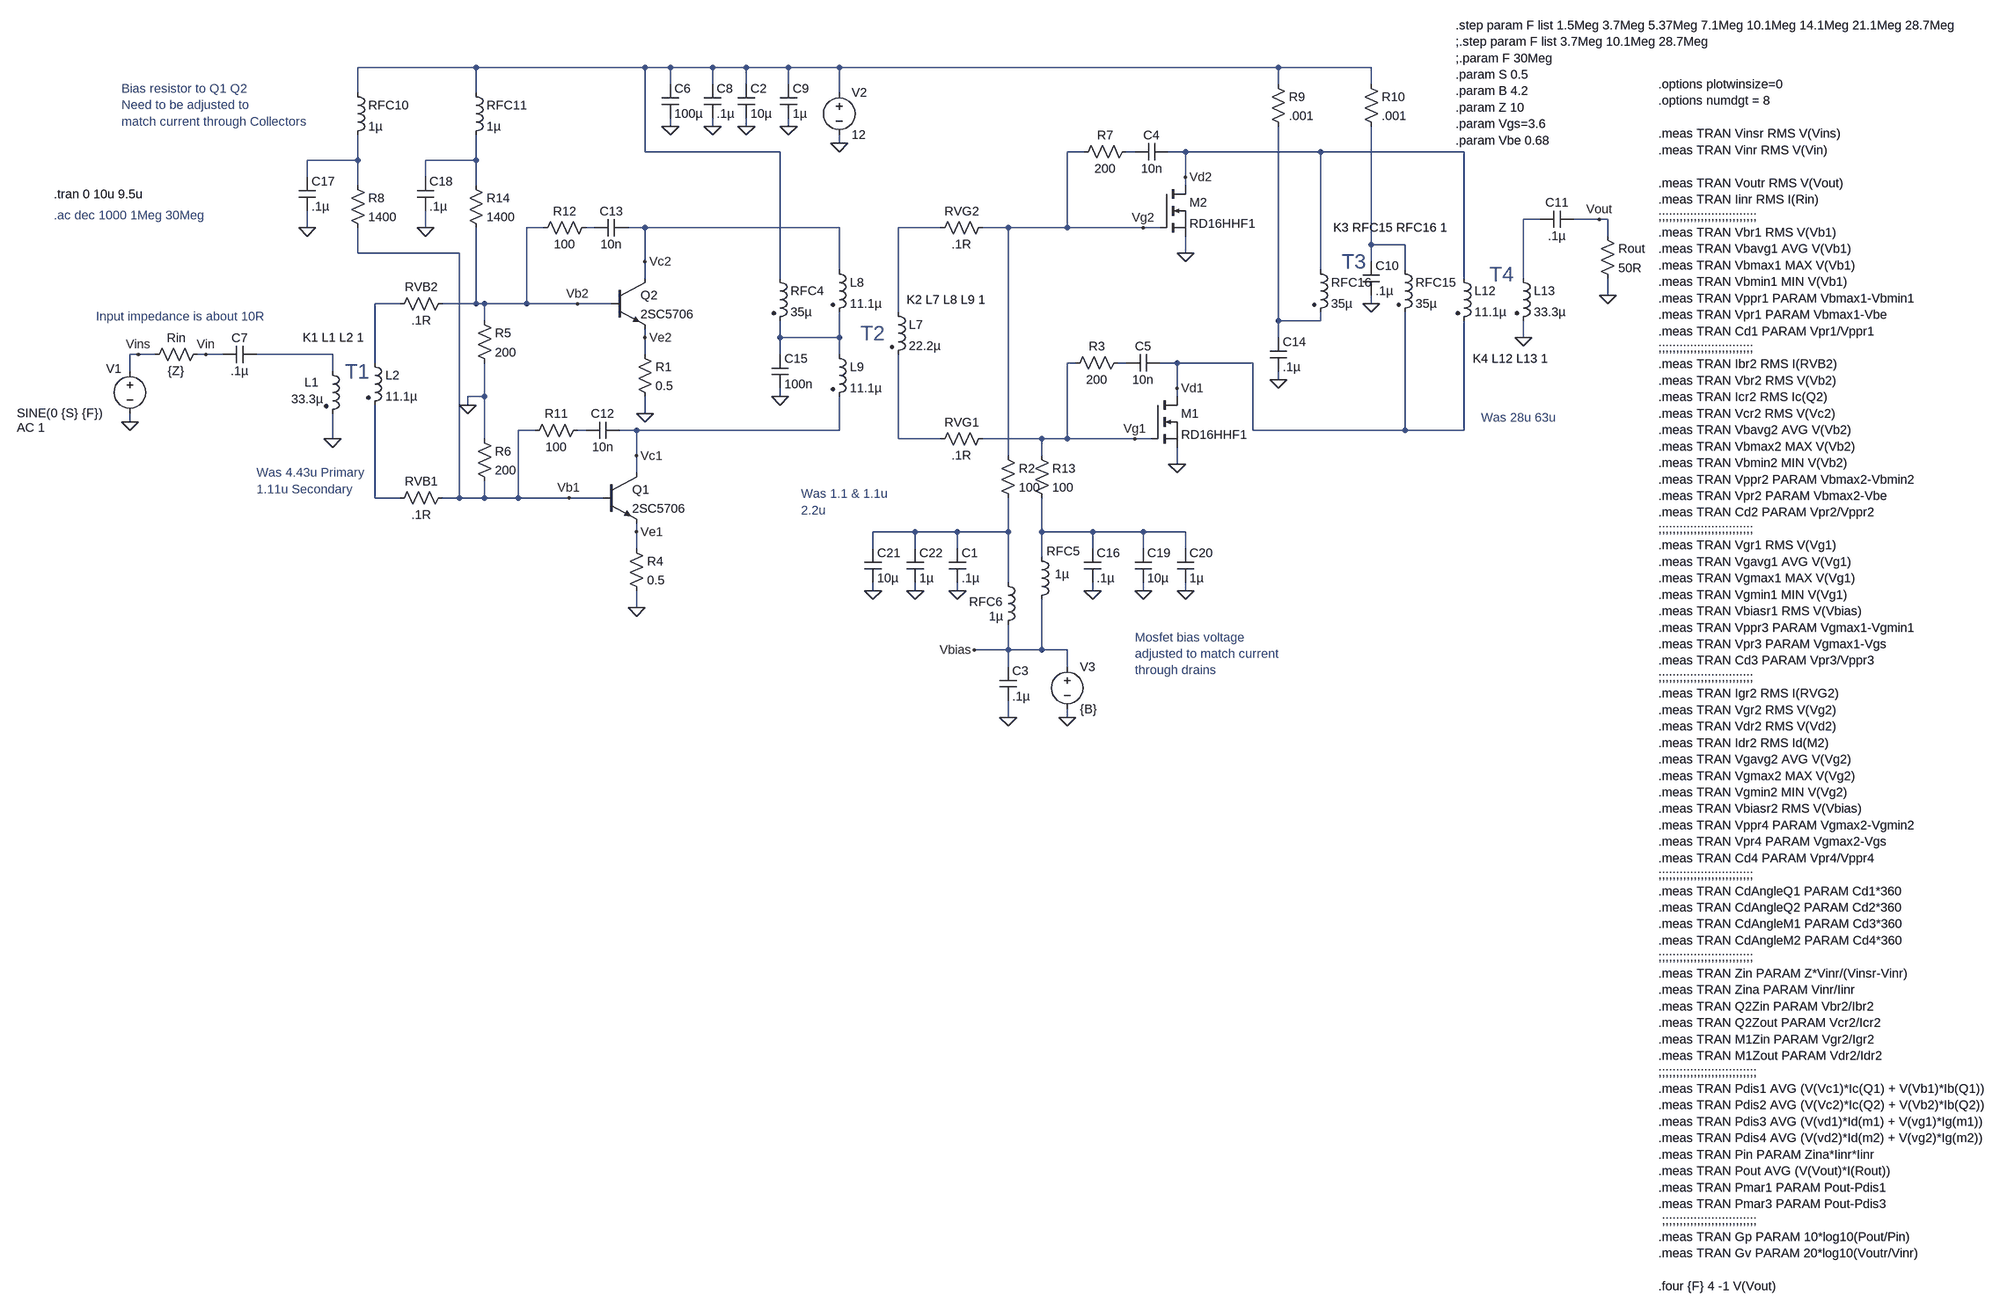
[diagram p0: schematic 2SC5706 RD16HHF 10W.asc]
2SC5706 RD16HHF 10W.asc, the LTspice schematic file:
Version 4
SHEET 1 3748 1496
WIRE 112 -624 -112 -624
WIRE 432 -624 112 -624
WIRE 480 -624 432 -624
WIRE 560 -624 480 -624
WIRE 624 -624 560 -624
WIRE 704 -624 624 -624
WIRE 800 -624 704 -624
WIRE 1632 -624 800 -624
WIRE 1808 -624 1632 -624
WIRE 480 -592 480 -624
WIRE 560 -592 560 -624
WIRE 624 -592 624 -624
WIRE 704 -592 704 -624
WIRE 1632 -592 1632 -624
WIRE 1808 -592 1808 -624
WIRE -112 -576 -112 -624
WIRE 112 -576 112 -624
WIRE 800 -576 800 -624
WIRE 480 -512 480 -528
WIRE 560 -512 560 -528
WIRE 624 -512 624 -528
WIRE 704 -512 704 -528
WIRE 800 -480 800 -496
WIRE 432 -464 432 -624
WIRE 688 -464 432 -464
WIRE 1264 -464 1232 -464
WIRE 1360 -464 1344 -464
WIRE 1456 -464 1424 -464
WIRE 1712 -464 1456 -464
WIRE 1984 -464 1712 -464
WIRE -112 -448 -112 -496
WIRE -112 -448 -208 -448
WIRE 112 -448 112 -496
WIRE 112 -448 16 -448
WIRE -208 -416 -208 -448
WIRE 16 -416 16 -448
WIRE 1456 -416 1456 -464
WIRE -112 -400 -112 -448
WIRE 112 -400 112 -448
WIRE 1456 -400 1456 -416
WIRE 2128 -336 2096 -336
WIRE 2240 -336 2192 -336
WIRE 2256 -336 2240 -336
WIRE -208 -320 -208 -352
WIRE 16 -320 16 -352
WIRE 240 -320 208 -320
WIRE 336 -320 320 -320
WIRE 432 -320 400 -320
WIRE 800 -320 432 -320
WIRE 992 -320 912 -320
WIRE 1120 -320 1072 -320
WIRE 1232 -320 1232 -464
WIRE 1232 -320 1120 -320
WIRE 1376 -320 1232 -320
WIRE 1408 -320 1376 -320
WIRE 2256 -304 2256 -336
WIRE 1808 -288 1808 -512
WIRE 1872 -288 1808 -288
WIRE -112 -272 -112 -320
WIRE 80 -272 -112 -272
WIRE 1456 -272 1456 -304
WIRE 432 -256 432 -320
WIRE 1808 -256 1808 -288
WIRE 800 -240 800 -320
WIRE 1712 -240 1712 -464
WIRE 1872 -240 1872 -288
WIRE 432 -224 432 -256
WIRE 688 -224 688 -464
WIRE 1984 -224 1984 -464
WIRE 2096 -224 2096 -336
WIRE 2256 -192 2256 -224
WIRE -32 -176 -80 -176
WIRE 112 -176 112 -320
WIRE 112 -176 48 -176
WIRE 128 -176 112 -176
WIRE 208 -176 208 -320
WIRE 208 -176 128 -176
WIRE 304 -176 208 -176
WIRE 368 -176 304 -176
WIRE 1808 -176 1808 -192
WIRE 912 -160 912 -320
WIRE 128 -144 128 -176
WIRE 1632 -144 1632 -512
WIRE 1712 -144 1712 -160
WIRE 1712 -144 1632 -144
WIRE 432 -112 432 -128
WIRE 688 -112 688 -144
WIRE 800 -112 800 -160
WIRE 800 -112 688 -112
WIRE 1632 -112 1632 -144
WIRE 2096 -112 2096 -144
WIRE -528 -80 -544 -80
WIRE -496 -80 -528 -80
WIRE -400 -80 -416 -80
WIRE -368 -80 -400 -80
WIRE -160 -80 -304 -80
WIRE 432 -80 432 -112
WIRE 688 -80 688 -112
WIRE 800 -80 800 -112
WIRE -80 -64 -80 -176
WIRE 1248 -64 1232 -64
WIRE 1344 -64 1328 -64
WIRE 1440 -64 1408 -64
WIRE 1584 -64 1440 -64
WIRE -544 -48 -544 -80
WIRE -160 -48 -160 -80
WIRE 1632 -32 1632 -48
WIRE 1440 -16 1440 -64
WIRE 128 0 128 -64
WIRE 128 0 96 0
WIRE 688 0 688 -16
WIRE 1440 0 1440 -16
WIRE 96 16 96 0
WIRE 432 32 432 0
WIRE -544 48 -544 32
WIRE 224 64 192 64
WIRE 320 64 304 64
WIRE 416 64 384 64
WIRE 800 64 800 0
WIRE 800 64 416 64
WIRE 1584 64 1584 -64
WIRE 1872 64 1872 -160
WIRE 1872 64 1584 64
WIRE 1984 64 1984 -144
WIRE 1984 64 1872 64
WIRE -160 80 -160 32
WIRE 128 80 128 0
WIRE 912 80 912 -80
WIRE 992 80 912 80
WIRE 1184 80 1072 80
WIRE 1232 80 1232 -64
WIRE 1232 80 1184 80
WIRE 1360 80 1232 80
WIRE 1392 80 1360 80
WIRE 416 112 416 64
WIRE 1120 112 1120 -320
WIRE 1184 112 1184 80
WIRE 1440 128 1440 96
WIRE 416 144 416 112
WIRE -80 192 -80 16
WIRE -32 192 -80 192
WIRE 80 192 80 -272
WIRE 80 192 48 192
WIRE 128 192 128 160
WIRE 128 192 80 192
WIRE 192 192 192 64
WIRE 192 192 128 192
WIRE 288 192 192 192
WIRE 352 192 288 192
WIRE 416 256 416 240
WIRE 944 256 864 256
WIRE 1024 256 944 256
WIRE 1120 256 1120 192
WIRE 1120 256 1024 256
WIRE 1184 256 1184 192
WIRE 1280 256 1184 256
WIRE 1376 256 1280 256
WIRE 1456 256 1376 256
WIRE 416 288 416 256
WIRE 864 288 864 256
WIRE 944 288 944 256
WIRE 1024 288 1024 256
WIRE 1280 288 1280 256
WIRE 1376 288 1376 256
WIRE 1456 288 1456 256
WIRE 1184 304 1184 256
WIRE 1120 352 1120 256
WIRE 864 368 864 352
WIRE 944 368 944 352
WIRE 1024 368 1024 352
WIRE 1280 368 1280 352
WIRE 1376 368 1376 352
WIRE 1456 368 1456 352
WIRE 416 400 416 368
WIRE 1120 480 1120 432
WIRE 1120 480 1056 480
WIRE 1184 480 1184 384
WIRE 1184 480 1120 480
WIRE 1232 480 1184 480
WIRE 1120 512 1120 480
WIRE 1232 512 1232 480
WIRE 1120 608 1120 576
WIRE 1232 608 1232 592
FLAG 800 -480 0
FLAG -544 48 0
FLAG 416 400 0
FLAG 2240 -336 Vout
FLAG 288 192 Vb1
FLAG 416 256 Ve1
FLAG -400 -80 Vin
FLAG -528 -80 Vins
FLAG 416 112 Vc1
FLAG 432 32 0
FLAG 304 -176 Vb2
FLAG 432 -112 Ve2
FLAG 432 -256 Vc2
FLAG -160 80 0
FLAG 96 16 0
FLAG 624 -512 0
FLAG 704 -512 0
FLAG 480 -512 0
FLAG 560 -512 0
FLAG 1232 608 0
FLAG 1440 128 0
FLAG 1360 80 Vg1
FLAG 1440 -16 Vd1
FLAG 1120 608 0
FLAG 1056 480 Vbias
FLAG 1456 -272 0
FLAG 1376 -320 Vg2
FLAG 1456 -416 Vd2
FLAG 1808 -176 0
FLAG 2096 -112 0
FLAG 2256 -192 0
FLAG 1632 -32 0
FLAG 688 0 0
FLAG 1024 368 0
FLAG 1280 368 0
FLAG -208 -320 0
FLAG 16 -320 0
FLAG 1376 368 0
FLAG 1456 368 0
FLAG 864 368 0
FLAG 944 368 0
SYMBOL npn 352 144 R0
SYMATTR InstName Q1
SYMATTR Value 2SC5706
SYMBOL voltage -544 -64 R0
WINDOW 0 -45 11 Left 2
WINDOW 3 -214 95 Left 2
WINDOW 123 -214 123 Left 2
WINDOW 39 0 0 Left 0
SYMATTR InstName V1
SYMATTR Value SINE(0 {S} {F})
SYMATTR Value2 AC 1
SYMBOL voltage 800 -592 R0
WINDOW 123 0 0 Left 0
WINDOW 39 0 0 Left 0
SYMATTR InstName V2
SYMATTR Value 12
SYMBOL res 400 272 R0
SYMATTR InstName R4
SYMATTR Value 0.5
SYMBOL res 2240 -320 R0
SYMATTR InstName Rout
SYMATTR Value 50R
SYMBOL cap -304 -96 R90
WINDOW 0 0 32 VBottom 2
WINDOW 3 32 32 VTop 2
SYMATTR InstName C7
SYMATTR Value .1µ
SYMBOL res -400 -96 R90
WINDOW 0 0 56 VBottom 2
WINDOW 3 32 56 VTop 2
SYMATTR InstName Rin
SYMATTR Value {Z}
SYMBOL npn 368 -224 R0
SYMATTR InstName Q2
SYMATTR Value 2SC5706
SYMBOL res 416 -96 R0
SYMATTR InstName R1
SYMATTR Value 0.5
SYMBOL ind2 -176 -64 R0
WINDOW 0 -37 37 Left 2
WINDOW 3 -62 69 Left 2
SYMATTR InstName L1
SYMATTR Value 33.3µ
SYMATTR Type ind
SYMBOL ind2 -96 -80 R0
SYMATTR InstName L2
SYMATTR Value 11.1µ
SYMATTR Type ind
SYMBOL res -128 -416 R0
SYMATTR InstName R8
SYMATTR Value 1400
SYMBOL res 112 -160 R0
SYMATTR InstName R5
SYMATTR Value 200
SYMBOL res 112 64 R0
SYMATTR InstName R6
SYMATTR Value 200
SYMBOL ind2 784 -256 R0
SYMATTR InstName L8
SYMATTR Value 11.1µ
SYMATTR Type ind
SYMBOL ind2 896 -176 R0
SYMATTR InstName L7
SYMATTR Value 22.2µ
SYMATTR Type ind
SYMBOL cap 608 -592 R0
SYMATTR InstName C2
SYMATTR Value 10µ
SYMBOL cap 688 -592 R0
SYMATTR InstName C9
SYMATTR Value 1µ
SYMBOL cap 464 -592 R0
SYMATTR InstName C6
SYMATTR Value 100µ
SYMBOL cap 544 -592 R0
SYMATTR InstName C8
SYMATTR Value .1µ
SYMBOL voltage 1232 496 R0
WINDOW 123 0 0 Left 2
WINDOW 39 0 0 Left 2
SYMATTR InstName V3
SYMATTR Value {B}
SYMBOL res 1104 96 R0
SYMATTR InstName R2
SYMATTR Value 100
SYMBOL nmos 1392 0 R0
SYMATTR InstName M1
SYMATTR Value RD16HHF1
SYMBOL cap 1104 512 R0
SYMATTR InstName C3
SYMATTR Value .1µ
SYMBOL nmos 1408 -400 R0
SYMATTR InstName M2
SYMATTR Value RD16HHF1
SYMBOL ind2 1968 -240 R0
SYMATTR InstName L12
SYMATTR Value 11.1µ
SYMATTR Type ind
SYMBOL ind2 1856 -256 R0
SYMATTR InstName RFC15
SYMATTR Value 35µ
SYMATTR Type ind
SYMBOL cap 1792 -256 R0
SYMATTR InstName C10
SYMATTR Value .1µ
SYMBOL cap 2192 -352 R90
WINDOW 0 0 32 VBottom 2
WINDOW 3 32 32 VTop 2
SYMATTR InstName C11
SYMATTR Value .1µ
SYMBOL cap 1616 -112 R0
SYMATTR InstName C14
SYMATTR Value .1µ
SYMBOL ind2 1696 -256 R0
SYMATTR InstName RFC16
SYMATTR Value 35µ
SYMATTR Type ind
SYMBOL ind2 2080 -240 R0
SYMATTR InstName L13
SYMATTR Value 33.3µ
SYMATTR Type ind
SYMBOL res 1616 -608 R0
SYMATTR InstName R9
SYMATTR Value .001
SYMBOL res 1792 -608 R0
SYMATTR InstName R10
SYMATTR Value .001
SYMBOL res 64 -192 R90
WINDOW 0 0 56 VBottom 2
WINDOW 3 32 56 VTop 2
SYMATTR InstName RVB2
SYMATTR Value .1R
SYMBOL res 64 176 R90
WINDOW 0 0 56 VBottom 2
WINDOW 3 32 56 VTop 2
SYMATTR InstName RVB1
SYMATTR Value .1R
SYMBOL res 1088 64 R90
WINDOW 0 0 56 VBottom 2
WINDOW 3 32 56 VTop 2
SYMATTR InstName RVG1
SYMATTR Value .1R
SYMBOL res 1088 -336 R90
WINDOW 0 0 56 VBottom 2
WINDOW 3 32 56 VTop 2
SYMATTR InstName RVG2
SYMATTR Value .1R
SYMBOL cap 1424 -480 R90
WINDOW 0 0 32 VBottom 2
WINDOW 3 32 32 VTop 2
SYMATTR InstName C4
SYMATTR Value 10n
SYMBOL cap 1408 -80 R90
WINDOW 0 0 32 VBottom 2
WINDOW 3 32 32 VTop 2
SYMATTR InstName C5
SYMATTR Value 10n
SYMBOL res 1344 -80 R90
WINDOW 0 0 56 VBottom 2
WINDOW 3 32 56 VTop 2
SYMATTR InstName R3
SYMATTR Value 200
SYMBOL res 1360 -480 R90
WINDOW 0 0 56 VBottom 2
WINDOW 3 32 56 VTop 2
SYMATTR InstName R7
SYMATTR Value 200
SYMBOL cap 384 48 R90
WINDOW 0 0 32 VBottom 2
WINDOW 3 32 32 VTop 2
SYMATTR InstName C12
SYMATTR Value 10n
SYMBOL res 320 48 R90
WINDOW 0 0 56 VBottom 2
WINDOW 3 32 56 VTop 2
SYMATTR InstName R11
SYMATTR Value 100
SYMBOL cap 400 -336 R90
WINDOW 0 0 32 VBottom 2
WINDOW 3 32 32 VTop 2
SYMATTR InstName C13
SYMATTR Value 10n
SYMBOL res 336 -336 R90
WINDOW 0 0 56 VBottom 2
WINDOW 3 32 56 VTop 2
SYMATTR InstName R12
SYMATTR Value 100
SYMBOL ind2 672 -240 R0
SYMATTR InstName RFC4
SYMATTR Value 35µ
SYMATTR Type ind
SYMBOL cap 672 -80 R0
SYMATTR InstName C15
SYMATTR Value 100n
SYMBOL ind2 784 -96 R0
SYMATTR InstName L9
SYMATTR Value 11.1µ
SYMATTR Type ind
SYMBOL res 1168 96 R0
SYMATTR InstName R13
SYMATTR Value 100
SYMBOL ind 1168 288 R0
WINDOW 0 25 5 Left 2
WINDOW 3 41 48 Left 2
SYMATTR InstName RFC5
SYMATTR Value 1µ
SYMBOL ind 1104 336 R0
WINDOW 0 -58 53 Left 2
WINDOW 3 -20 80 Left 2
SYMATTR InstName RFC6
SYMATTR Value 1µ
SYMBOL cap 1008 288 R0
SYMATTR InstName C1
SYMATTR Value .1µ
SYMBOL cap 1264 288 R0
SYMATTR InstName C16
SYMATTR Value .1µ
SYMBOL ind -128 -592 R0
SYMATTR InstName RFC10
SYMATTR Value 1µ
SYMBOL cap -224 -416 R0
SYMATTR InstName C17
SYMATTR Value .1µ
SYMBOL res 96 -416 R0
SYMATTR InstName R14
SYMATTR Value 1400
SYMBOL ind 96 -592 R0
SYMATTR InstName RFC11
SYMATTR Value 1µ
SYMBOL cap 0 -416 R0
SYMATTR InstName C18
SYMATTR Value .1µ
SYMBOL cap 1360 288 R0
SYMATTR InstName C19
SYMATTR Value 10µ
SYMBOL cap 1440 288 R0
SYMATTR InstName C20
SYMATTR Value 1µ
SYMBOL cap 848 288 R0
SYMATTR InstName C21
SYMATTR Value 10µ
SYMBOL cap 928 288 R0
SYMATTR InstName C22
SYMATTR Value 1µ
TEXT -688 -384 Left 2 !.tran 0 10u 9.5u
TEXT 2352 -592 Left 2 !.options plotwinsize=0\n.options numdgt = 8\n \n.meas TRAN Vinsr RMS V(Vins)\n.meas TRAN Vinr RMS V(Vin)\n \n.meas TRAN Voutr RMS V(Vout)\n.meas TRAN Iinr RMS I(Rin)\n;;;;;;;;;;;;;;;;;;;;;;;;;;;;\n.meas TRAN Vbr1 RMS V(Vb1)\n.meas TRAN Vbavg1 AVG V(Vb1)\n.meas TRAN Vbmax1 MAX V(Vb1)\n.meas TRAN Vbmin1 MIN V(Vb1)\n.meas TRAN Vppr1 PARAM Vbmax1-Vbmin1\n.meas TRAN Vpr1 PARAM Vbmax1-Vbe\n.meas TRAN Cd1 PARAM Vpr1/Vppr1\n;;;;;;;;;;;;;;;;;;;;;;;;;;;\n.meas TRAN Ibr2 RMS I(RVB2)\n.meas TRAN Vbr2 RMS V(Vb2)\n.meas TRAN Icr2 RMS Ic(Q2)\n.meas TRAN Vcr2 RMS V(Vc2)\n.meas TRAN Vbavg2 AVG V(Vb2)\n.meas TRAN Vbmax2 MAX V(Vb2)\n.meas TRAN Vbmin2 MIN V(Vb2)\n.meas TRAN Vppr2 PARAM Vbmax2-Vbmin2\n.meas TRAN Vpr2 PARAM Vbmax2-Vbe\n.meas TRAN Cd2 PARAM Vpr2/Vppr2\n;;;;;;;;;;;;;;;;;;;;;;;;;;;\n.meas TRAN Vgr1 RMS V(Vg1)\n.meas TRAN Vgavg1 AVG V(Vg1)\n.meas TRAN Vgmax1 MAX V(Vg1)\n.meas TRAN Vgmin1 MIN V(Vg1)\n.meas TRAN Vbiasr1 RMS V(Vbias)\n.meas TRAN Vppr3 PARAM Vgmax1-Vgmin1\n.meas TRAN Vpr3 PARAM Vgmax1-Vgs\n.meas TRAN Cd3 PARAM Vpr3/Vppr3\n;;;;;;;;;;;;;;;;;;;;;;;;;;;\n.meas TRAN Igr2 RMS I(RVG2)\n.meas TRAN Vgr2 RMS V(Vg2)\n.meas TRAN Vdr2 RMS V(Vd2)\n.meas TRAN Idr2 RMS Id(M2)\n.meas TRAN Vgavg2 AVG V(Vg2)\n.meas TRAN Vgmax2 MAX V(Vg2)\n.meas TRAN Vgmin2 MIN V(Vg2)\n.meas TRAN Vbiasr2 RMS V(Vbias)\n.meas TRAN Vppr4 PARAM Vgmax2-Vgmin2\n.meas TRAN Vpr4 PARAM Vgmax2-Vgs\n.meas TRAN Cd4 PARAM Vpr4/Vppr4\n;;;;;;;;;;;;;;;;;;;;;;;;;;;\n.meas TRAN CdAngleQ1 PARAM Cd1*360\n.meas TRAN CdAngleQ2 PARAM Cd2*360\n.meas TRAN CdAngleM1 PARAM Cd3*360\n.meas TRAN CdAngleM2 PARAM Cd4*360\n;;;;;;;;;;;;;;;;;;;;;;;;;;;\n.meas TRAN Zin PARAM Z*Vinr/(Vinsr-Vinr)\n.meas TRAN Zina PARAM Vinr/Iinr \n.meas TRAN Q2Zin PARAM Vbr2/Ibr2\n.meas TRAN Q2Zout PARAM Vcr2/Icr2 \n.meas TRAN M1Zin PARAM Vgr2/Igr2 \n.meas TRAN M1Zout PARAM Vdr2/Idr2 \n;;;;;;;;;;;;;;;;;;;;;;;;;;;;\n.meas TRAN Pdis1 AVG (V(Vc1)*Ic(Q1) + V(Vb1)*Ib(Q1))\n.meas TRAN Pdis2 AVG (V(Vc2)*Ic(Q2) + V(Vb2)*Ib(Q2))\n.meas TRAN Pdis3 AVG (V(vd1)*Id(m1) + V(vg1)*Ig(m1))\n.meas TRAN Pdis4 AVG (V(vd2)*Id(m2) + V(vg2)*Ig(m2))\n.meas TRAN Pin PARAM Zina*Iinr*Iinr\n.meas TRAN Pout AVG (V(Vout)*I(Rout))\n.meas TRAN Pmar1 PARAM Pout-Pdis1\n.meas TRAN Pmar3 PARAM Pout-Pdis3\n ;;;;;;;;;;;;;;;;;;;;;;;;;;;\n.meas TRAN Gp PARAM 10*log10(Pout/Pin)\n.meas TRAN Gv PARAM 20*log10(Voutr/Vinr)\n \n.four {F} 4 -1 V(Vout)
TEXT 1968 -704 Left 2 !.step param F list 1.5Meg 3.7Meg 5.37Meg 7.1Meg 10.1Meg 14.1Meg 21.1Meg 28.7Meg\n;.step param F list 3.7Meg 10.1Meg 28.7Meg\n;.param F 30Meg\n.param S 0.5\n.param B 4.2\n.param Z 10\n.param Vgs=3.6\n.param Vbe 0.68
TEXT -688 -344 Left 2 ;.ac dec 1000 1Meg 30Meg
TEXT 928 -184 Left 2 !K2 L7 L8 L9 1
TEXT -216 -112 Left 2 !K1 L1 L2 1
TEXT 2000 -72 Left 2 !K4 L12 L13 1
TEXT 1736 -320 Left 2 !K3 RFC15 RFC16 1
TEXT -304 144 Left 2 ;Was 4.43u Primary\n1.11u Secondary
TEXT 728 184 Left 2 ;Was 1.1 & 1.1u\n2.2u
TEXT 2016 40 Left 2 ;Was 28u 63u
TEXT -560 -584 Left 2 ;Bias resistor to Q1 Q2\nNeed to be adjusted to \nmatch current through Collectors
TEXT 1360 456 Left 2 ;Mosfet bias voltage\nadjusted to match current\nthrough drains
TEXT -136 -48 Left 4 ;T1
TEXT 840 -120 Left 4 ;T2
TEXT 1752 -256 Left 4 ;T3
TEXT 2032 -232 Left 4 ;T4
TEXT -608 -152 Left 2 ;Input impedance is about 10R

The netlist it stands for:
* 2SC5706 RD16HHF 10W.asc
Q1 Vc1 Vb1 Ve1 0 2SC5706
V1 Vins 0 SINE(0 {S} {F}) AC 1
V2 N001 0 12
R4 Ve1 0 0.5
Rout Vout 0 50R
C7 N012 Vin .1µ
Rin Vin Vins {Z}
Q2 Vc2 Vb2 Ve2 0 2SC5706
R1 Ve2 0 0.5
L1 N012 0 33.3µ
L2 N009 N016 11.1µ
R8 N003 Vb1 1400
R5 Vb2 0 200
R6 0 Vb1 200
L8 Vc2 N011 11.1µ
L7 N007 N015 22.2µ
C2 N001 0 10µ
C9 N001 0 1µ
C6 N001 0 100µ
C8 N001 0 .1µ
V3 Vbias 0 {B}
R2 Vg2 N017 100
M1 Vd1 Vg1 0 0 RD16HHF1
C3 Vbias 0 .1µ
M2 Vd2 Vg2 0 0 RD16HHF1
L12 Vd2 Vd1 11.1µ
L§RFC15 N008 Vd1 35µ
C10 N008 0 .1µ
C11 Vout N005 .1µ
C14 N010 0 .1µ
L§RFC16 Vd2 N010 35µ
L13 N005 0 33.3µ
R9 N001 N010 .001
R10 N001 N008 .001
RVB2 Vb2 N009 .1R
RVB1 Vb1 N016 .1R
RVG1 Vg1 N015 .1R
RVG2 Vg2 N007 .1R
C4 Vd2 N002 10n
C5 Vd1 N013 10n
R3 N013 Vg1 200
R7 N002 Vg2 200
C12 Vc1 N014 10n
R11 N014 Vb1 100
C13 Vc2 N006 10n
R12 N006 Vb2 100
L§RFC4 N001 N011 35µ
C15 N011 0 100n
L9 N011 Vc1 11.1µ
R13 Vg1 N018 100
L§RFC5 N018 Vbias 1µ
L§RFC6 N017 Vbias 1µ
C1 N017 0 .1µ
C16 N018 0 .1µ
L§RFC10 N001 N003 1µ
C17 N003 0 .1µ
R14 N004 Vb2 1400
L§RFC11 N001 N004 1µ
C18 N004 0 .1µ
C19 N018 0 10µ
C20 N018 0 1µ
C21 N017 0 10µ
C22 N017 0 1µ
.model NPN NPN
.model PNP PNP
.lib standard.bjt
.model NMOS NMOS
.model PMOS PMOS
.lib standard.mos
.tran 0 10u 9.5u
.options plotwinsize=0
.options numdgt = 8
.meas TRAN Vinsr RMS V(Vins)
.meas TRAN Vinr RMS V(Vin)
.meas TRAN Voutr RMS V(Vout)
.meas TRAN Iinr RMS I(Rin)
;;;;;;;;;;;;;;;;;;;;;;;;;;;;
.meas TRAN Vbr1 RMS V(Vb1)
.meas TRAN Vbavg1 AVG V(Vb1)
.meas TRAN Vbmax1 MAX V(Vb1)
.meas TRAN Vbmin1 MIN V(Vb1)
.meas TRAN Vppr1 PARAM Vbmax1-Vbmin1
.meas TRAN Vpr1 PARAM Vbmax1-Vbe
.meas TRAN Cd1 PARAM Vpr1/Vppr1
;;;;;;;;;;;;;;;;;;;;;;;;;;;
.meas TRAN Ibr2 RMS I(RVB2)
.meas TRAN Vbr2 RMS V(Vb2)
.meas TRAN Icr2 RMS Ic(Q2)
.meas TRAN Vcr2 RMS V(Vc2)
.meas TRAN Vbavg2 AVG V(Vb2)
.meas TRAN Vbmax2 MAX V(Vb2)
.meas TRAN Vbmin2 MIN V(Vb2)
.meas TRAN Vppr2 PARAM Vbmax2-Vbmin2
.meas TRAN Vpr2 PARAM Vbmax2-Vbe
.meas TRAN Cd2 PARAM Vpr2/Vppr2
;;;;;;;;;;;;;;;;;;;;;;;;;;;
.meas TRAN Vgr1 RMS V(Vg1)
.meas TRAN Vgavg1 AVG V(Vg1)
.meas TRAN Vgmax1 MAX V(Vg1)
.meas TRAN Vgmin1 MIN V(Vg1)
.meas TRAN Vbiasr1 RMS V(Vbias)
.meas TRAN Vppr3 PARAM Vgmax1-Vgmin1
.meas TRAN Vpr3 PARAM Vgmax1-Vgs
.meas TRAN Cd3 PARAM Vpr3/Vppr3
;;;;;;;;;;;;;;;;;;;;;;;;;;;
.meas TRAN Igr2 RMS I(RVG2)
.meas TRAN Vgr2 RMS V(Vg2)
.meas TRAN Vdr2 RMS V(Vd2)
.meas TRAN Idr2 RMS Id(M2)
.meas TRAN Vgavg2 AVG V(Vg2)
.meas TRAN Vgmax2 MAX V(Vg2)
.meas TRAN Vgmin2 MIN V(Vg2)
.meas TRAN Vbiasr2 RMS V(Vbias)
.meas TRAN Vppr4 PARAM Vgmax2-Vgmin2
.meas TRAN Vpr4 PARAM Vgmax2-Vgs
.meas TRAN Cd4 PARAM Vpr4/Vppr4
;;;;;;;;;;;;;;;;;;;;;;;;;;;
.meas TRAN CdAngleQ1 PARAM Cd1*360
.meas TRAN CdAngleQ2 PARAM Cd2*360
.meas TRAN CdAngleM1 PARAM Cd3*360
.meas TRAN CdAngleM2 PARAM Cd4*360
;;;;;;;;;;;;;;;;;;;;;;;;;;;
.meas TRAN Zin PARAM Z*Vinr/(Vinsr-Vinr)
.meas TRAN Zina PARAM Vinr/Iinr
.meas TRAN Q2Zin PARAM Vbr2/Ibr2
.meas TRAN Q2Zout PARAM Vcr2/Icr2
.meas TRAN M1Zin PARAM Vgr2/Igr2
.meas TRAN M1Zout PARAM Vdr2/Idr2
;;;;;;;;;;;;;;;;;;;;;;;;;;;;
.meas TRAN Pdis1 AVG (V(Vc1)*Ic(Q1) + V(Vb1)*Ib(Q1))
.meas TRAN Pdis2 AVG (V(Vc2)*Ic(Q2) + V(Vb2)*Ib(Q2))
.meas TRAN Pdis3 AVG (V(vd1)*Id(m1) + V(vg1)*Ig(m1))
.meas TRAN Pdis4 AVG (V(vd2)*Id(m2) + V(vg2)*Ig(m2))
.meas TRAN Pin PARAM Zina*Iinr*Iinr
.meas TRAN Pout AVG (V(Vout)*I(Rout))
.meas TRAN Pmar1 PARAM Pout-Pdis1
.meas TRAN Pmar3 PARAM Pout-Pdis3
 ;;;;;;;;;;;;;;;;;;;;;;;;;;;
.meas TRAN Gp PARAM 10*log10(Pout/Pin)
.meas TRAN Gv PARAM 20*log10(Voutr/Vinr)
.four {F} 4 -1 V(Vout)
.step param F list 1.5Meg 3.7Meg 5.37Meg 7.1Meg 10.1Meg 14.1Meg 21.1Meg 28.7Meg
;.step param F list 3.7Meg 10.1Meg 28.7Meg
;.param F 30Meg
.param S 0.5
.param B 4.2
.param Z 10
.param Vgs=3.6
.param Vbe 0.68
* .ac dec 1000 1Meg 30Meg
K2 L7 L8 L9 1
K1 L1 L2 1
K4 L12 L13 1
K3 RFC15 RFC16 1
* Was 4.43u Primary
* 1.11u Secondary
* Was 1.1 & 1.1u
* 2.2u
* Was 28u 63u
* Bias resistor to Q1 Q2
* Need to be adjusted to
* match current through Collectors
* Mosfet bias voltage
* adjusted to match current
* through drains
* T1
* T2
* T3
* T4
* Input impedance is about 10R
.backanno
.end